# EAGLE board VCFA_v2_mix (EAGLE 9.4.2)
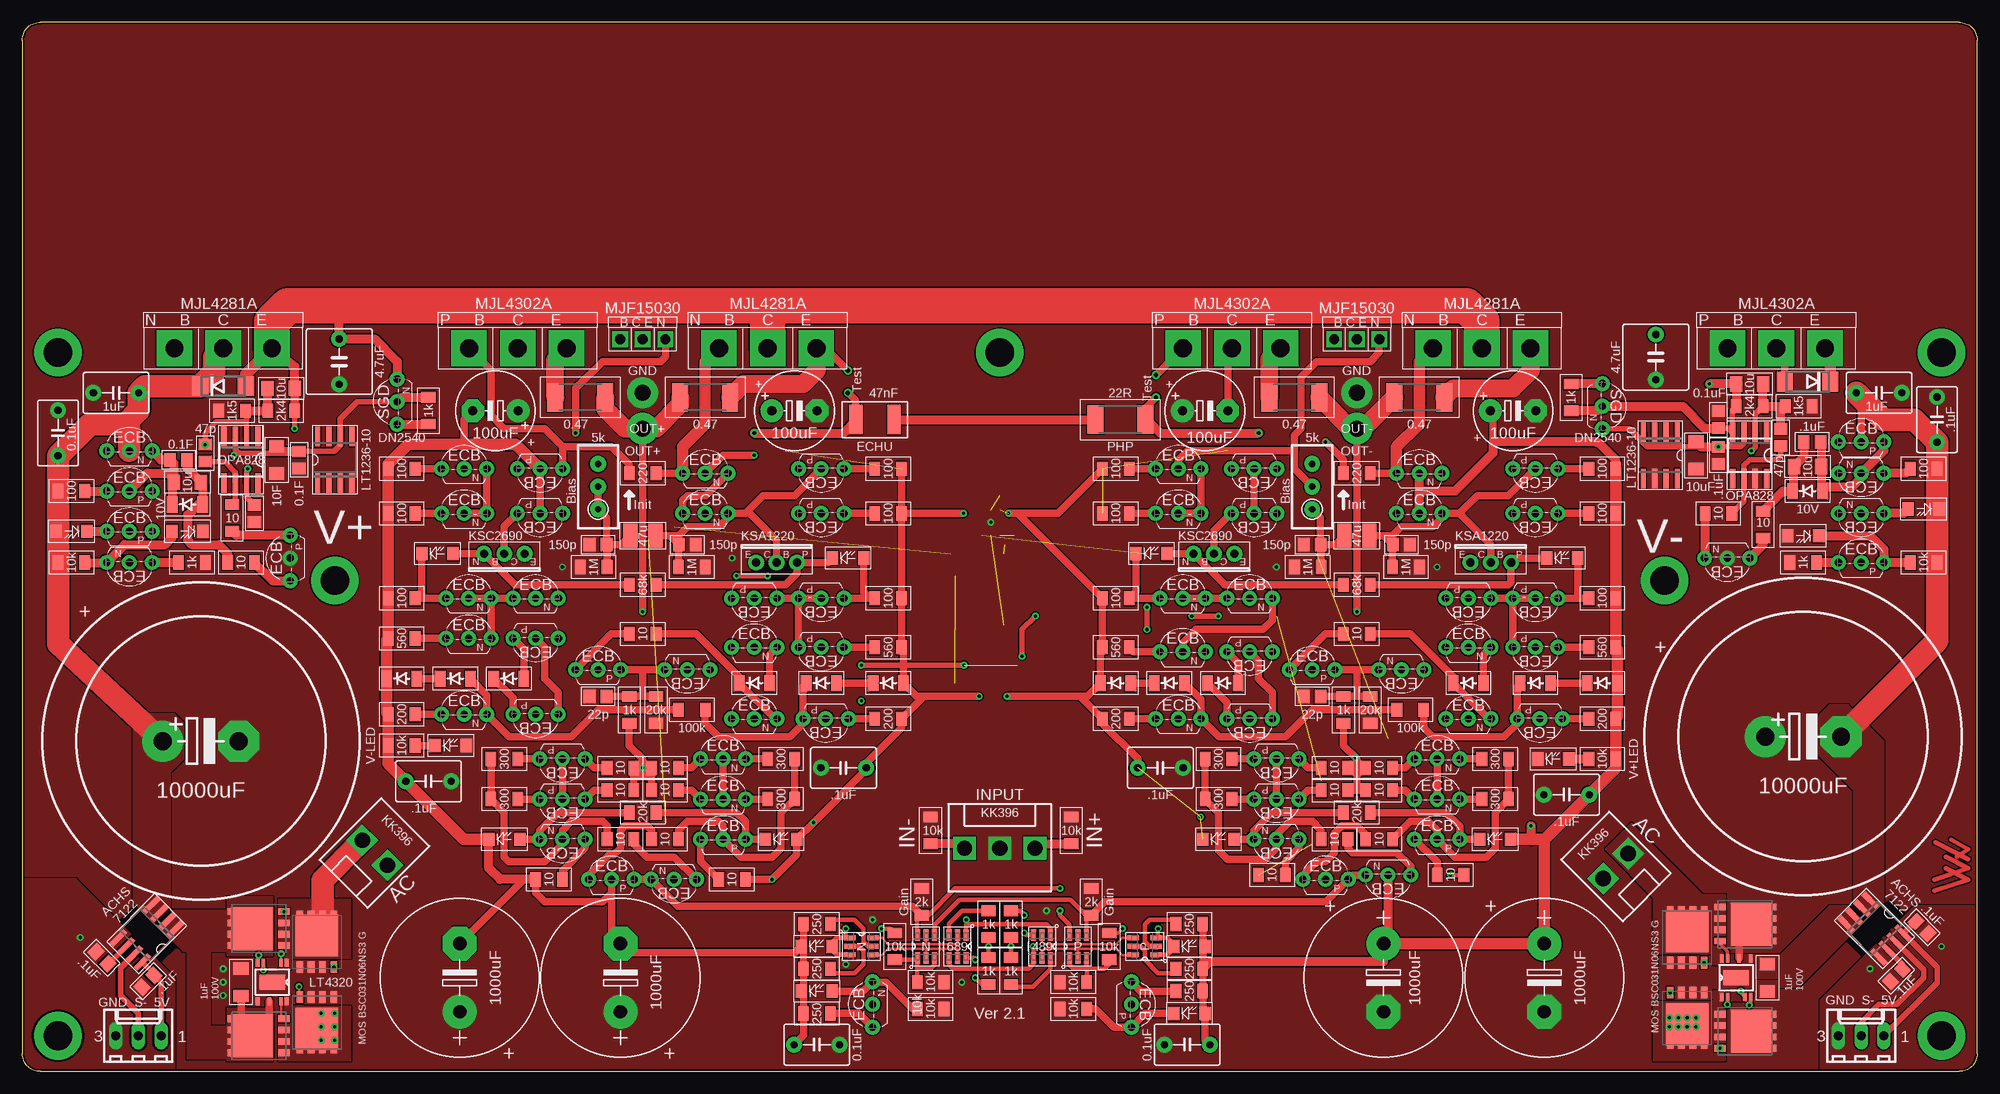
[diagram p4: board, top side]
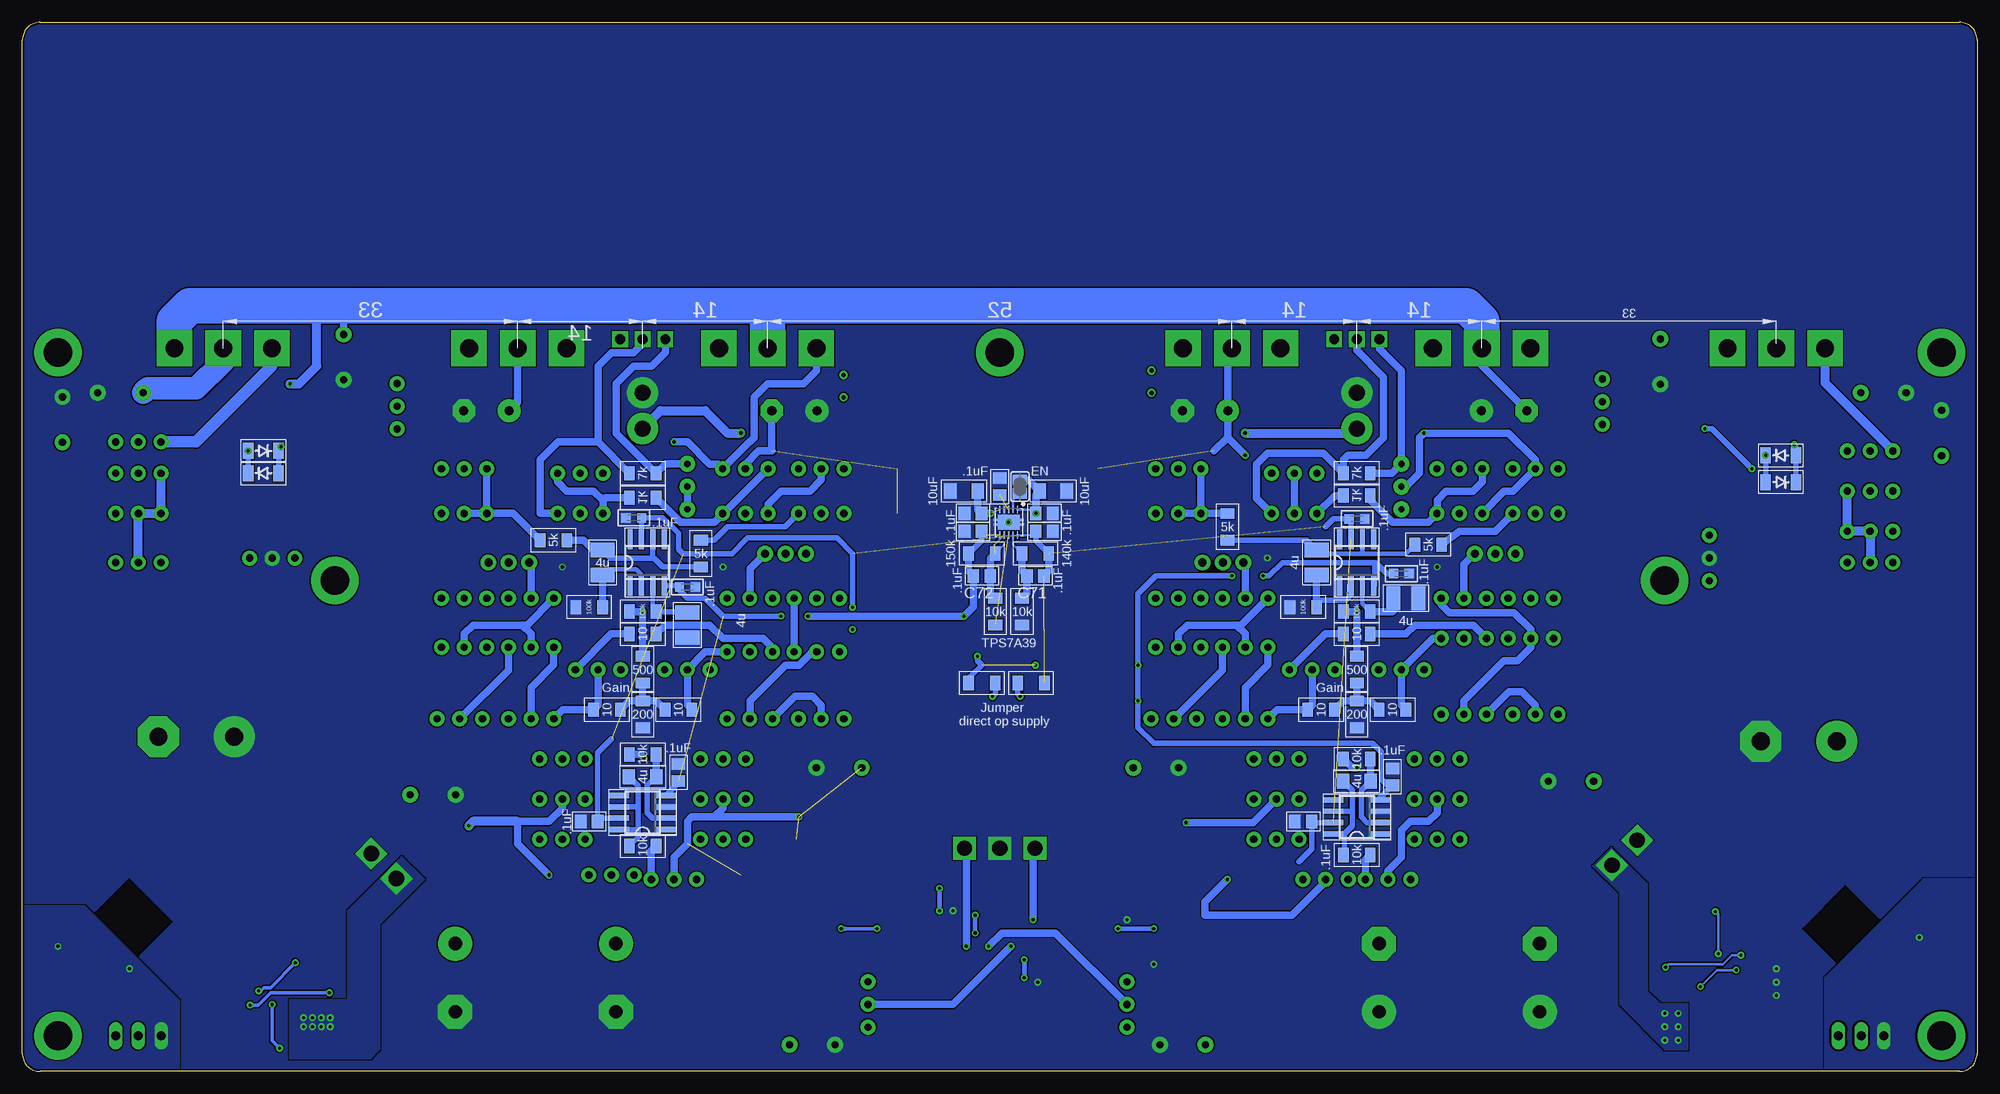
[diagram p5: board, bottom side, seen from below]

Size 219 x 117.5 mm. Coordinates in mm from the lower left corner, seen from the top.
Outline: 2,0 217,0 arc90 219,2 219,115.5 arc90 217,117.5 2,117.5 arc90 0,115.5 0,2 arc90 2,0
Copper layers (1*16): Top 0.035mm / dielectric 1.5mm / Bottom 0.035mm
Design rules "default *": minimum track width 6mil, minimum drill 0.35mm, track to track 6mil, track to pad 6mil, pad to pad 6mil, via to via 6mil, smd to smd 0mil, copper to edge 10mil, drill to drill 6mil, minimum pad ring 10mil, minimum via ring 8mil, stop-mask expansion 4mil, vias tented up to drill 0.35mm, thermal gap 3mil

## Footprints (pad centres in the part's own frame; a part is rotated, then mirrored left to right if it is on the bottom)
ECHU-Y = smd 1.5 x 3.3: 1 -2.15,0; 2 2.15,0
C0805 = smd 1.3 x 1.5: 1 -0.95,0; 2 0.95,0
E7,5-18 = drill 1.5 pad 3.81: + -3.81,0 | drill 1.5 pad 3.81 octagon: - 3.81,0
C050-045X075 = drill 0.813 pad 1.778: 1 -2.54,0; 2 2.54,0
C1206 = smd 1.4 x 1.7: 1 -1.527,0; 2 1.527,0
C1210 = smd 1.6 x 2.7: 1 -1.4,0; 2 1.4,0
C0603K = smd 1.05 x 1.08: 1 -0.875,0; 2 0.875,0
E5-8,5 = drill 1.016 pad 2.54: + -2.54,0 | drill 1.016 pad 2.54 octagon: - 2.54,0
EB35D-8.5 = drill 2.007 pad 4.597: + -4.25,0 | drill 2.007 pad 4.597 octagon: - 4.25,0
C050-075X075 = drill 0.813 pad 1.778: 1 -2.54,0; 2 2.54,0
SOD80C = smd 1.2 x 1.8: A 1.7,0; C -1.7,0
DO214AA = smd 1.8 x 2.2: A 2.55,0; C -2.55,0
SO8 = smd 0.6 x 2.2: 1 -1.905,-2.6; 2 -0.635,-2.6; 3 0.635,-2.6; 4 1.905,-2.6; 5 1.905,2.6; 6 0.635,2.6; 7 -0.635,2.6; 8 -1.905,2.6
M3_HOLE = drill 3.2 pad 5.334: P$1 0,0
SOIC8 = smd 0.6 x 2.2: 1 -1.905,-2.6; 2 -0.635,-2.6; 3 0.635,-2.6; 4 1.905,-2.6; 5 1.905,2.6; 6 0.635,2.6; 7 -0.635,2.6; 8 -1.905,2.6
6410-03 = drill 1.016 long: 1 2.54,0; 2 0,0; 3 -2.54,0
LED_SML1206 = smd 1.3 x 1.5: A 1.75,0; C -1.75,0
PAD-16 = drill 1.8 pad 3.5: P$1 0,0
SOT-23-6 = smd 1.27 x 0.559: 1 -1.295,0.95; 2 -1.295,0; 3 -1.295,-0.95; 4 1.295,-0.95; 5 1.295,0; 6 1.295,0.95
TRANSISTOR_TO92-ECB_P = drill 0.813 pad 1.676: B 2.54,0; C 0,0; E -2.54,0
TRANSISTOR_TO92-ECB_N = drill 0.813 pad 1.676: B 2.54,0; C 0,0; E -2.54,0
TRANSISTOR_TO126_P = drill 0.9 pad 1.778: B 2.286,0; C 0,0; E -2.286,0
TRANSISTOR_TO126_N = drill 0.9 pad 1.778: B 2.286,0; C 0,0; E -2.286,0
TRANSISTOR_TO220_BCE_N = drill 1.1 pad 1.778 square: B -2.54,0; C 0,0; E 2.54,0
TRANSISTOR_TO247_BCE_N = drill 2 pad 4 square: B -5.461,0; C 0,0; E 5.461,0
TRANSISTOR_TO247_BCE_P = drill 2 pad 4 square: B -5.461,0; C 0,0; E 5.461,0
TRANSISTOR_TO92-SGD_N = drill 0.813 pad 1.676: D 2.54,0; G 0,0; S -2.54,0
PG-TDSON-8 = smd 1.3 x 0.75: 1 -2.825,1.905; 2 -2.825,0.635; 3 -2.825,-0.635; 4 -2.825,-1.905; 5 2.825,-1.905; 6 2.825,-0.635; 7 2.825,0.635; 8 2.825,1.905 | smd 4.7 x 4.8: TH 0.725,0
MINI_MELF-0204W = smd 1.2 x 1.6: 1 -1.5,0; 2 1.5,0
RTRIM3296W = drill 0.7 pad 1.778: 1 0,-2.54; 2 0,0; 3 0,2.54
R2512 = smd 1.8 x 3.2: 1 -2.8,0; 2 2.8,0
SJ = smd 1.168 x 1.6: 1 -0.762,0; 2 0.762,0
LT4320_MSOP = smd 0.9 x 0.42: 1 -2.163,1.625; 2 -2.163,0.975; 5 -2.163,-0.975; 6 -2.163,-1.625; 7 2.15,-1.625; 9 2.15,-0.325; 11 2.15,0.975; 12 2.15,1.625 | smd 1.65 x 2.85: EXP 0,0
SON50P300X300X80-11T165X240N = smd 0.86 x 0.27: 1 -1.435,1; 2 -1.435,0.5; 3 -1.435,0; 4 -1.435,-0.5; 5 -1.435,-1; 6 1.435,-1; 7 1.435,-0.5; 8 1.435,0; 9 1.435,0.5; 10 1.435,1 | smd 1.65 x 2.4: 11 0,0 | smd 0.25 x 0.5: 12 0.25,1.45; 13 -0.25,1.435; 14 -0.25,-1.45; 15 0.25,-1.45
KK-156-3 = drill 1.7 pad 2.54 square: 1 -3.96,0; 2 0,0; 3 3.96,0
KK-156-2 = drill 1.7 pad 2.54 square: 1 -1.98,0; 2 1.98,0

## Placement (x,y rotation side)
C1  [ECHU-Y]  95.5,73 0 top
C2  0.1uF  [C0805]  109.5,65.5 90 bottom
C3  0.1uF  [C0805]  75.5,28 0 bottom
C4  0.1uF  [C0805]  65.5,33 90 bottom
C5  1000uF  [E7,5-18]  152.5,10.5 270 top
C6  1000uF  [E7,5-18]  49,10.5 90 top
C7  1000uF  [E7,5-18]  170.5,10.5 270 top
C8  1000uF  [E7,5-18]  67,10.5 90 top
C9  0.1uF  [C050-045X075]  92,34 180 top
C10  0.1uF  [C050-045X075]  127.5,34 180 top
C11  0.1uF  [C050-045X075]  173,31 180 top
C12  0.1uF  [C050-045X075]  45.5,32.5 180 top
C13  10uF  [C1206]  69.5,32.5 0 bottom
C14  0.1uF  [C0805]  155.5,28 0 bottom
C15  0.1uF  [C0805]  145.5,33.5 90 bottom
C16  10uF  [C1206]  149.5,33 0 bottom
C17  22p  [C0805]  64.5,42 180 top
C18  47u  [C1210]  69.5,60 180 top
C19  150p  [C0805]  74.5,59 180 top
C20  150p  [C0805]  64.5,59 180 top
C21  4.7uF  [C1210]  74,57 270 bottom
C22  4.7uF  [C1210]  64,53 180 bottom
C23  0.1uF  [C0603K]  69.46,61.89 0 bottom
C24  0.1uF  [C0603K]  64.5,55.75 180 bottom
C25  100uF  [E5-8,5]  86.5,74 0 top
C26  100uF  [E5-8,5]  53,74 180 top
C27  22p  [C0805]  144.5,42 180 top
C28  47u  [C1210]  149.5,60 180 top
C29  150p  [C0805]  154.5,59 180 top
C30  150p  [C0805]  144.5,59 180 top
C31  4.7uF  [C1210]  154,57 270 bottom
C32  4.7uF  [C1210]  144.5,50 90 bottom
C33  0.1uF  [C0603K]  150.5,62 180 bottom
C34  0.1uF  [C0603K]  144.5,54.25 180 bottom
C35  100uF  [E5-8,5]  167,74 0 top
C36  100uF  [E5-8,5]  132.5,74 0 top
C37  10000uF  [EB35D-8.5]  20,37 0 top
C38  10000uF  [EB35D-8.5]  199.5,37.5 0 top
C39  0.1uF  [C050-045X075]  208,76 0 top
C40  10uF  [C1206]  18.5,66 0 top
C41  10uF  [C1206]  200,67.75 0 top
C42  0.1uF  [C050-045X075]  10.5,76 0 top
C43  0.1uF  [C0805]  17.5,68.5 0 top
C44  0.1uF  [C0805]  200.5,70.5 0 top
C45  0.1uF  [C0805]  26,62.5 90 top
C46  0.1uF  [C0805]  190,73 90 top
C47  10uF  [C1206]  28.5,68.5 270 top
C48  10uF  [C1206]  187.5,69 90 top
C49  0.1uF  [C0805]  31,68.5 270 top
C50  0.1uF  [C0805]  190,69 90 top
C51  47p  [C0805]  20.5,69.25 90 top
C52  47p  [C0805]  197,71 90 top
C53  10uF  [C1206]  29,76.5 180 top
C54  10uF  [C1206]  193.5,77 180 top
C55  4.7uF  [C050-075X075]  35.5,79.5 90 top
C56  4.7uF  [C050-075X075]  183,80 270 top
C57  47uF  [C1206]  24.5,10 90 top
C58  0.1uF  [C050-045X075]  4,71.5 270 top
C59  47uF  [C1206]  195.5,10.5 90 top
C60  0.1uF  [C050-045X075]  214.5,73 90 top
C61  [C0805]  212.82,16.13 315 top
C62  [C0805]  209.95,10.73 225 top
C63  1n  [C0805]  8.91,12.73 135 top
C64  [C0805]  14.09,10.1 225 top
C65  10uF  [C1206]  113.5,65 180 bottom
C66  10uF  [C1206]  103.5,65 0 bottom
C67  0.1uF  [C0805]  112.5,62.5 180 bottom
C68  0.1uF  [C0805]  104.5,62.5 0 bottom
C69  0.1uF  [C0805]  104.5,60.5 0 bottom
C70  0.1uF  [C0805]  112.5,60.5 0 bottom
C71  0.1uF  [C0805]  105.5,55.5 180 bottom
C72  0.1uF  [C0805]  111.5,55.5 180 bottom
C74  0.1uF  [C050-045X075]  130.5,3 180 top
C75  0.1uF  [C050-045X075]  89,3 180 top
D1  LL4148  [SOD80C]  97,43.5 0 top
D2  LL4148  [SOD80C]  89.5,43.5 0 top
D3  LL4148  [SOD80C]  48.5,44 0 top
D4  LL4148  [SOD80C]  42.5,44 0 top
D5  LL4148  [SOD80C]  82,43.5 0 top
D6  LL4148  [SOD80C]  54.5,44 0 top
D7  LL4148  [SOD80C]  177,43.5 0 top
D8  LL4148  [SOD80C]  169.5,43.5 0 top
D9  LL4148  [SOD80C]  128.5,43.5 0 top
D10  LL4148  [SOD80C]  122.5,43.5 0 top
D11  LL4148  [SOD80C]  162,43.5 0 top
D12  LL4148  [SOD80C]  134.5,43.5 0 top
D13  BZT55B10  [SOD80C]  18.5,63.5 0 top
D14  BZT55B10  [SOD80C]  200,65 0 top
D15  S1G  [DO214AA]  22.5,76.75 0 top
D16  S1G  [DO214AA]  200,77.25 180 top
D17  LT1236-10  [SO8]  35,68.5 0 top
D18  LT1236-10  [SO8]  183.5,69 180 top
D19  LL4148  [SOD80C]  22,69 0 bottom
D20  LL4148  [SOD80C]  22,66 180 bottom
D21  LL4148  [SOD80C]  192,67 0 bottom
D22  LL4148  [SOD80C]  192,69.5 180 bottom
H1  HOLE  [M3_HOLE]  4,4 0 top
H2  HOLE  [M3_HOLE]  215,4 0 top
H3  HOLE  [M3_HOLE]  4,80.5 0 top
H4  HOLE  [M3_HOLE]  215,80.5 0 top
H5  HOLE  [M3_HOLE]  35,55 0 top
H6  HOLE  [M3_HOLE]  129,-13 0 top  (outside the outline)
H7  HOLE  [M3_HOLE]  184,55 0 top
H8  HOLE  [M3_HOLE]  109.5,80.5 0 top
IC1  LTC2057HV  [SOIC8]  69.5,28.5 90 bottom
IC2  LTC2057HV  [SOIC8]  149.5,29 90 bottom
IC3  LTC2057HV  [SOIC8]  69.5,57 0 bottom
IC4  LTC2057HV  [SOIC8]  149,57 0 bottom
IC5  OPA827  [SOIC8]  193.5,69 180 top
IC6  OPA827  [SOIC8]  24.5,68.5 180 top
J1  22-27-2031-03  [6410-03]  13,4 0 top
J2  22-27-2031-03  [6410-03]  206,4 0 top
LED1  RED  [LED_SML1206]  130.75,6.5 0 top
LED2  RED  [LED_SML1206]  89,9 0 top
LED3  RED  [LED_SML1206]  130.75,14 0 top
LED4  RED  [LED_SML1206]  89,14 0 top
LED5  RED  [LED_SML1206]  85,26 0 top
LED6  RED  [LED_SML1206]  54,26 0 top
LED7  RED  [LED_SML1206]  165,26 0 top
LED8  RED  [LED_SML1206]  134,26 0 top
LED9  RED  [LED_SML1206]  92.5,57.5 0 top
LED10  RED  [LED_SML1206]  46.5,58 0 top
LED11  RED  [LED_SML1206]  172.5,57.5 0 top
LED12  RED  [LED_SML1206]  126.5,58 0 top
LED13  RED  [LED_SML1206]  18.5,60.5 180 top
LED14  RED  [LED_SML1206]  199.5,60 180 top
LED15  RED  [LED_SML1206]  5.5,60.5 180 top
LED16  RED  [LED_SML1206]  213,63 180 top
LED17  RED  [LED_SML1206]  171.5,35 0 top
LED18  RED  [LED_SML1206]  48,36.5 0 top
PAD1  PAD  [PAD-16]  69.5,72 0 top
PAD2  PAD  [PAD-16]  149.5,72 0 top
PAD3  PAD  [PAD-16]  149.5,76 0 top
PAD4  PAD  [PAD-16]  69.5,76 0 top
Q1  LSK689  [SOT-23-6]  104.75,14 270 top
Q2  KSA992  [TRANSISTOR_TO92-ECB_P]  124.25,7.5 270 top
Q3  KSC1845  [TRANSISTOR_TO92-ECB_N]  95.25,7.5 90 top
Q4  LSK489  [SOT-23-6]  114.25,14 270 top
Q5  LS3550  [SOT-23-6]  118.25,14 90 top
Q6  LS3250  [SOT-23-6]  101.25,14 90 top
Q7  LS3250  [SOT-23-6]  94,14 0 top
Q8  LS3550  [SOT-23-6]  125.75,14 180 top
Q9  KSC1845  [TRANSISTOR_TO92-ECB_N]  73,21.5 180 top
Q10  KSA992  [TRANSISTOR_TO92-ECB_P]  66,21.5 0 top
Q11  KSA992  [TRANSISTOR_TO92-ECB_P]  78.5,26 0 top
Q12  KSC1845  [TRANSISTOR_TO92-ECB_N]  60.5,26 180 top
Q13  KSC1845  [TRANSISTOR_TO92-ECB_N]  78.5,35 0 top
Q14  KSA992  [TRANSISTOR_TO92-ECB_P]  60.5,35 180 top
Q15  KSC1845  [TRANSISTOR_TO92-ECB_N]  78.5,30.5 0 top
Q16  KSA992  [TRANSISTOR_TO92-ECB_P]  60.5,30.5 180 top
Q17  KSC1845  [TRANSISTOR_TO92-ECB_N]  153,22 180 top
Q18  KSA992  [TRANSISTOR_TO92-ECB_P]  146,21.5 0 top
Q19  KSA992  [TRANSISTOR_TO92-ECB_P]  158.5,26 0 top
Q20  KSC1845  [TRANSISTOR_TO92-ECB_N]  140.5,26 180 top
Q21  KSC1845  [TRANSISTOR_TO92-ECB_N]  158.5,35 0 top
Q22  KSA992  [TRANSISTOR_TO92-ECB_P]  140.5,35 180 top
Q23  KSC1845  [TRANSISTOR_TO92-ECB_N]  158.5,30.5 0 top
Q24  KSA992  [TRANSISTOR_TO92-ECB_P]  140.5,30.5 180 top
Q25  KSA992  [TRANSISTOR_TO92-ECB_P]  90,39.5 180 top
Q26  KSA992  [TRANSISTOR_TO92-ECB_P]  64.5,45 0 top
Q27  KSC1845  [TRANSISTOR_TO92-ECB_N]  74.5,45 180 top
Q28  KSC1845  [TRANSISTOR_TO92-ECB_N]  49.5,40 0 top
Q29  KSC1845  [TRANSISTOR_TO92-ECB_N]  82,47.5 0 top
Q30  KSC1845  [TRANSISTOR_TO92-ECB_N]  82,39.5 0 top
Q31  KSA992  [TRANSISTOR_TO92-ECB_P]  57.5,48.5 180 top
Q32  KSA992  [TRANSISTOR_TO92-ECB_P]  57.5,40 180 top
Q33  KSA992  [TRANSISTOR_TO92-ECB_P]  89.5,47.5 180 top
Q34  KSC1845  [TRANSISTOR_TO92-ECB_N]  50,48.5 0 top
Q35  KSA992  [TRANSISTOR_TO92-ECB_P]  89.5,53 180 top
Q36  KSA992  [TRANSISTOR_TO92-ECB_P]  82,53 180 top
Q37  KSC1845  [TRANSISTOR_TO92-ECB_N]  57.5,53 0 top
Q38  KSC1845  [TRANSISTOR_TO92-ECB_N]  50,53 0 top
Q39  KSA1220  [TRANSISTOR_TO126_P]  84.5,57 0 top
Q40  KSC2690  [TRANSISTOR_TO126_N]  54,58 180 top
Q41  KSA992  [TRANSISTOR_TO92-ECB_P]  89.5,62.5 180 top
Q42  KSC1845  [TRANSISTOR_TO92-ECB_N]  49.5,62.5 0 top
Q43  KSA992  [TRANSISTOR_TO92-ECB_P]  89.5,67.5 180 top
Q44  KSC1845  [TRANSISTOR_TO92-ECB_N]  49.5,67.5 0 top
Q45  MJE15030  [TRANSISTOR_TO220_BCE_N]  69.5,82 0 top
Q46  KSC1845  [TRANSISTOR_TO92-ECB_N]  76.5,62.5 0 top
Q47  KSA992  [TRANSISTOR_TO92-ECB_P]  58,62.5 180 top
Q48  KSC1845  [TRANSISTOR_TO92-ECB_N]  76.5,67 0 top
Q49  KSA992  [TRANSISTOR_TO92-ECB_P]  58,67.5 180 top
Q50  MJL4281A  [TRANSISTOR_TO247_BCE_N]  83.5,81 0 top
Q51  MJL4302A  [TRANSISTOR_TO247_BCE_P]  55.5,81 0 top
Q52  KSA992  [TRANSISTOR_TO92-ECB_P]  170,39.5 180 top
Q53  KSA992  [TRANSISTOR_TO92-ECB_P]  144.5,45 0 top
Q54  KSC1845  [TRANSISTOR_TO92-ECB_N]  154.5,45 180 top
Q55  KSC1845  [TRANSISTOR_TO92-ECB_N]  129.5,39.5 0 top
Q56  KSC1845  [TRANSISTOR_TO92-ECB_N]  162,47.5 0 top
Q57  KSC1845  [TRANSISTOR_TO92-ECB_N]  162,39.5 0 top
Q58  KSA992  [TRANSISTOR_TO92-ECB_P]  137.5,47 180 top
Q59  KSA992  [TRANSISTOR_TO92-ECB_P]  137.5,39.5 180 top
Q60  KSA992  [TRANSISTOR_TO92-ECB_P]  169.5,47.5 180 top
Q61  KSC1845  [TRANSISTOR_TO92-ECB_N]  130,47 0 top
Q62  KSA992  [TRANSISTOR_TO92-ECB_P]  169.5,53 180 top
Q63  KSA992  [TRANSISTOR_TO92-ECB_P]  162,53 180 top
Q64  KSC1845  [TRANSISTOR_TO92-ECB_N]  137.5,53 0 top
Q65  KSC1845  [TRANSISTOR_TO92-ECB_N]  130,53 0 top
Q66  KSA1220  [TRANSISTOR_TO126_P]  164.5,57 0 top
Q67  KSC2690  [TRANSISTOR_TO126_N]  133.5,58 180 top
Q68  KSA992  [TRANSISTOR_TO92-ECB_P]  169.5,62.5 180 top
Q69  KSC1845  [TRANSISTOR_TO92-ECB_N]  129.5,62.5 0 top
Q70  KSA992  [TRANSISTOR_TO92-ECB_P]  169.5,67.5 180 top
Q71  KSC1845  [TRANSISTOR_TO92-ECB_N]  129.5,67.5 0 top
Q72  MJE15030  [TRANSISTOR_TO220_BCE_N]  149.5,82 0 top
Q73  KSC1845  [TRANSISTOR_TO92-ECB_N]  156.5,62.5 0 top
Q74  KSA992  [TRANSISTOR_TO92-ECB_P]  138,62.5 180 top
Q75  KSC1845  [TRANSISTOR_TO92-ECB_N]  156.5,67 0 top
Q76  KSA992  [TRANSISTOR_TO92-ECB_P]  138,67.5 180 top
Q77  MJL4281A  [TRANSISTOR_TO247_BCE_N]  163.5,81 0 top
Q78  MJL4302A  [TRANSISTOR_TO247_BCE_P]  135.5,81 0 top
Q79  KSC1845  [TRANSISTOR_TO92-ECB_N]  12,57 180 top
Q80  KSA992  [TRANSISTOR_TO92-ECB_P]  206,57 0 top
Q81  KSA992  [TRANSISTOR_TO92-ECB_P]  12,60.5 0 top
Q82  KSC1845  [TRANSISTOR_TO92-ECB_N]  206,62.5 180 top
Q83  KSA992  [TRANSISTOR_TO92-ECB_P]  12,65 0 top
Q84  KSC1845  [TRANSISTOR_TO92-ECB_N]  206,67 180 top
Q85  KSA992  [TRANSISTOR_TO92-ECB_P]  30,57.5 90 top
Q86  KSC1845  [TRANSISTOR_TO92-ECB_N]  191,57.5 180 top
Q87  KSC1845  [TRANSISTOR_TO92-ECB_N]  12,69.5 0 top
Q88  KSA992  [TRANSISTOR_TO92-ECB_P]  206,70.5 0 top
Q89  MJL4281A  [TRANSISTOR_TO247_BCE_N]  22.5,81 0 top
Q90  MJL4302A  [TRANSISTOR_TO247_BCE_P]  196.5,81 0 top
Q91  DN2540  [TRANSISTOR_TO92-SGD_N]  42,75 90 top
Q92  DN2540  [TRANSISTOR_TO92-SGD_N]  177,74.5 270 top
Q97  MOS_SMDTDSON-8  [PG-TDSON-8]  26.5,16 180 top
Q98  MOS_SMDTDSON-8  [PG-TDSON-8]  26.5,4 180 top
Q99  MOS_SMDTDSON-8  [PG-TDSON-8]  33,5.5 270 top
Q100  MOS_SMDTDSON-8  [PG-TDSON-8]  33,14.5 90 top
Q105  MOS_SMDTDSON-8  [PG-TDSON-8]  193,4.5 0 top
Q106  MOS_SMDTDSON-8  [PG-TDSON-8]  193,16.5 0 top
Q107  MOS_SMDTDSON-8  [PG-TDSON-8]  186.5,15 90 top
Q108  MOS_SMDTDSON-8  [PG-TDSON-8]  186.5,6 270 top
R3  10K  [MINI_MELF-0204W]  117.75,7 0 top
R4  10K  [MINI_MELF-0204W]  101.75,7 0 top
R5  250  [MINI_MELF-0204W]  130.75,9 0 top
R6  1K  [MINI_MELF-0204W]  108.25,16.5 270 top
R7  250  [MINI_MELF-0204W]  89,6.5 0 top
R8  1K  [MINI_MELF-0204W]  108.25,11.25 90 top
R9  1K  [MINI_MELF-0204W]  110.75,16.5 90 top
R10  1K  [MINI_MELF-0204W]  110.75,11.25 270 top
R11  2k  [MINI_MELF-0204W]  100.75,19 270 top
R12  250  [MINI_MELF-0204W]  130.75,16.5 0 top
R13  250  [MINI_MELF-0204W]  89,16.5 0 top
R14  10K  [MINI_MELF-0204W]  121.75,14 90 top
R15  10K  [MINI_MELF-0204W]  117.75,10 0 top
R16  10K  [MINI_MELF-0204W]  101.75,10 0 top
R17  10K  [MINI_MELF-0204W]  97.75,14 270 top
R18  250  [MINI_MELF-0204W]  130.75,11.5 0 top
R19  250  [MINI_MELF-0204W]  89,11.5 0 top
R20  2k  [MINI_MELF-0204W]  119.75,19 270 top
R21  10K  [MINI_MELF-0204W]  69.5,24.25 0 bottom
R22  20K  [MINI_MELF-0204W]  69.5,29 0 top
R23  250  [MINI_MELF-0204W]  79.5,21.5 0 top
R24  10  [MINI_MELF-0204W]  72,26 180 top
R25  10  [MINI_MELF-0204W]  67,26 180 top
R26  250  [MINI_MELF-0204W]  59,21.5 0 top
R27  300  [MINI_MELF-0204W]  85,35 0 top
R28  300  [MINI_MELF-0204W]  54,35 0 top
R29  10K  [MINI_MELF-0204W]  69.5,35 0 bottom
R30  10  [MINI_MELF-0204W]  72,34 0 top
R31  10  [MINI_MELF-0204W]  67,34 0 top
R32  300  [MINI_MELF-0204W]  85,30.5 0 top
R33  300  [MINI_MELF-0204W]  54,30.5 0 top
R34  10  [MINI_MELF-0204W]  72,31.5 0 top
R35  10  [MINI_MELF-0204W]  67,31.5 0 top
R36  10K  [MINI_MELF-0204W]  149.5,25.25 0 bottom
R37  20K  [MINI_MELF-0204W]  149.5,29 0 top
R38  250  [MINI_MELF-0204W]  160,22 0 top
R39  10  [MINI_MELF-0204W]  152,26 180 top
R40  10  [MINI_MELF-0204W]  147,26 180 top
R41  250  [MINI_MELF-0204W]  140,22 0 top
R42  300  [MINI_MELF-0204W]  165,35 0 top
R43  300  [MINI_MELF-0204W]  134,35 0 top
R44  10K  [MINI_MELF-0204W]  149.5,35.5 0 bottom
R45  10  [MINI_MELF-0204W]  152,34 0 top
R46  10  [MINI_MELF-0204W]  147,34 0 top
R47  300  [MINI_MELF-0204W]  165,30.5 0 top
R48  300  [MINI_MELF-0204W]  134,30.5 0 top
R49  10  [MINI_MELF-0204W]  152,31.5 0 top
R50  10  [MINI_MELF-0204W]  147,31.5 0 top
R51  1k  [MINI_MELF-0204W]  68,40.5 270 top
R52  20k  [MINI_MELF-0204W]  71,40.5 90 top
R53  100k  [MINI_MELF-0204W]  75,40.5 0 top
R54  200  [MINI_MELF-0204W]  97,39.5 0 top
R55  10  [MINI_MELF-0204W]  69.5,49 0 top
R56  10  [MINI_MELF-0204W]  69.5,49 180 bottom
R57  200  [MINI_MELF-0204W]  42.5,40 0 top
R58  560  [MINI_MELF-0204W]  97,47.5 0 top
R59  10  [MINI_MELF-0204W]  73.5,40.5 180 bottom
R60  10  [MINI_MELF-0204W]  65.5,40.5 180 bottom
R61  560  [MINI_MELF-0204W]  42.5,48.5 0 top
R62  100  [MINI_MELF-0204W]  97,53 0 top
R63  200  [MINI_MELF-0204W]  69.5,40 90 bottom
R64  100  [MINI_MELF-0204W]  42.5,53 0 top
R65  68k  [MINI_MELF-0204W]  69.5,54.5 0 top
R66  500  [MINI_MELF-0204W]  69.5,45 90 bottom
R67  100  [MINI_MELF-0204W]  97,62.5 0 top
R68  5k  [MINI_MELF-0204W]  84,61 90 bottom
R69  5k  [MINI_MELF-0204W]  61.5,59 180 bottom
R70  100  [MINI_MELF-0204W]  42.5,62.5 0 top
R71  100  [MINI_MELF-0204W]  97,67.5 0 top
R72  100  [MINI_MELF-0204W]  42.5,67.5 0 top
R73  7k  [MINI_MELF-0204W]  69.5,67 180 bottom
R74  5k  [RTRIM3296W]  64.5,65.5 0 top
R75  1M  [MINI_MELF-0204W]  75,56.5 0 top
R76  1M  [MINI_MELF-0204W]  64,56.5 0 top
R77  1k  [MINI_MELF-0204W]  69.5,64.5 180 bottom
R78  220  [MINI_MELF-0204W]  69.5,67 0 top
R79  100k  [MINI_MELF-0204W]  75.5,52 0 bottom
R80  0.5  [R2512]  76.5,75.5 0 top
R81  0.5  [R2512]  62.5,75.5 0 top
R82  100k  [MINI_MELF-0204W]  69.5,51.5 0 bottom
R83  1k  [MINI_MELF-0204W]  148,40.5 270 top
R84  20k  [MINI_MELF-0204W]  151,40.5 90 top
R85  100k  [MINI_MELF-0204W]  155.5,40.5 0 top
R86  200  [MINI_MELF-0204W]  177,39.5 0 top
R87  10  [MINI_MELF-0204W]  149.5,49 0 top
R88  10  [MINI_MELF-0204W]  149.5,49 180 bottom
R89  200  [MINI_MELF-0204W]  122.5,39.5 0 top
R90  560  [MINI_MELF-0204W]  177,47.5 0 top
R91  10  [MINI_MELF-0204W]  153.5,40.5 180 bottom
R92  10  [MINI_MELF-0204W]  145.5,40.5 180 bottom
R93  560  [MINI_MELF-0204W]  122.5,47.5 0 top
R94  100  [MINI_MELF-0204W]  177,53 0 top
R95  200  [MINI_MELF-0204W]  149.5,40 90 bottom
R96  100  [MINI_MELF-0204W]  122.5,53 0 top
R97  68k  [MINI_MELF-0204W]  149.5,54.5 0 top
R98  500  [MINI_MELF-0204W]  149.5,45 90 bottom
R99  100  [MINI_MELF-0204W]  177,62.5 0 top
R100  5k  [MINI_MELF-0204W]  159.5,59.5 180 bottom
R101  5k  [MINI_MELF-0204W]  143,58 270 bottom
R102  100  [MINI_MELF-0204W]  122.5,62.5 0 top
R103  100  [MINI_MELF-0204W]  177,67.5 0 top
R104  100  [MINI_MELF-0204W]  122.5,67.5 0 top
R105  7k  [MINI_MELF-0204W]  149.5,67 180 bottom
R106  5k  [RTRIM3296W]  144.5,65.5 0 top
R107  1M  [MINI_MELF-0204W]  155,56.5 0 top
R108  1M  [MINI_MELF-0204W]  144,56.5 0 top
R109  1k  [MINI_MELF-0204W]  149.5,64.25 180 bottom
R110  220  [MINI_MELF-0204W]  149.5,67 0 top
R111  100k  [MINI_MELF-0204W]  155.5,52 0 bottom
R112  0.5  [R2512]  156.5,75.5 0 top
R113  0.5  [R2512]  142.5,75.5 0 top
R114  100k  [MINI_MELF-0204W]  149.5,51.5 0 bottom
R115  10k  [MINI_MELF-0204W]  5.5,57 0 top
R116  10k  [MINI_MELF-0204W]  213,57 0 top
R117  1k  [MINI_MELF-0204W]  19,57 0 top
R118  1k  [MINI_MELF-0204W]  199.5,57 0 top
R119  100  [MINI_MELF-0204W]  5.5,65 0 top
R120  10  [MINI_MELF-0204W]  24.5,57 0 top
R121  10  [MINI_MELF-0204W]  195,61.25 90 top
R122  100  [MINI_MELF-0204W]  213,67.5 0 top
R123  10  [MINI_MELF-0204W]  23.5,62 270 top
R124  10  [MINI_MELF-0204W]  190,62.5 180 top
R125  1k  [MINI_MELF-0204W]  45.5,74 270 top
R126  1k  [MINI_MELF-0204W]  173.5,75.5 90 top
R127  1.5k  [MINI_MELF-0204W]  29,74 0 top
R128  1.5k  [MINI_MELF-0204W]  23.5,74 0 top
R129  1.5k  [MINI_MELF-0204W]  199,74.5 0 top
R130  1.5k  [MINI_MELF-0204W]  193.5,74.5 0 top
R131  10k  [MINI_MELF-0204W]  177,35 0 top
R132  10k  [MINI_MELF-0204W]  42.5,36.5 0 top
R133  [R2512]  123,73 0 top
R134  10K  [MINI_MELF-0204W]  117.5,27 270 top
R135  10K  [MINI_MELF-0204W]  101.75,27 270 top
R136  10k  [MINI_MELF-0204W]  105.5,58 0 bottom
R137  10k  [MINI_MELF-0204W]  107,51.5 90 bottom
R138  10k  [MINI_MELF-0204W]  110,51.5 270 bottom
R139  10k  [MINI_MELF-0204W]  111.5,58 0 bottom
R140  10k  [MINI_MELF-0204W]  111.5,43.5 0 bottom
R141  10k  [MINI_MELF-0204W]  106,43.5 180 bottom
S1  VWV  [VWV]  218,22.75 90 top
SJ1  [SJ]  107.25,65.5 90 bottom
U$1  ACHS-712X  [SO8]  13.94,15.44 135 top
U$2  LT4320MSOP  [LT4320_MSOP]  28,10 270 top
U$3  ACHS-712X  [SO8]  207.5,16 225 top
U$4  LT4320MSOP  [LT4320_MSOP]  192,10.5 90 top
U$5  TPS7A39WSON10-7A39  [SON50P300X300X80-11T165X240N]  108.5,61.5 270 bottom
X1  KK-156-3  [KK-156-3]  109.5,25 0 top
X2  [KK-156-2]  178.5,23 225 top
X3  [KK-156-2]  39.5,24.5 135 top

## Tracks (layer width: path | path; a pad name or v marks a point on that pad's centre or on a via)
+18V  (via drill 0.35)  (5 unrouted)
  Top 0.61: v126,52 v126,49.5
  Bottom 0.254: U$5.10 105.89,60.06 C69.1
  Bottom 0.61: IC4.7 C33.1 147.25,62 145.5,60.25 145.5,58.5 145,58 139.5,58 137.75,59.75 127.75,59.75 126,58 v126,52 | 73,61 72.11,61.89 C23.1 70.14,61.69 IC3.7 | IC1.7 74.42,27.86 C3.2 74.55,24.95 76,23.5 | C69.1 105.45,59.45 R136.2 | IC2.7 154.19,28.36 C14.2 154.55,35.7 153,37.25
  Bottom 0.813: C71.1 104,56.05 R136.2
-18V  (via drill 0.35)  (3 unrouted)
  Top 0.61: v134,51 v131,51 | v112,46.5 112,49.5 v113.5,51 | v105.5,45.5 v94,45.5 | v83.5,55.5 v80,55.5
  Bottom 0.254: 111.11,60.06 C70.2
  Bottom 0.61: IC4.4 145.53,54.4 C34.2 145.38,53.88 144.5,53 142.5,53 140.5,51 v134,51 | C24.2 66.12,55.75 67.38,57 67.5,57 | 67.5,57 77.82,57 79.32,55.5 v80,55.5 | IC1.4 66.9,30.65 C4.1 66.05,32.05 66.75,32.75 66.75,35.8 67.21,36.26 67.26,36.26 67.75,36.75 92.25,36.75 94,38.5 v94,41.5 v94,45.5 94,53.5 92,55.5 v83.5,55.5 | C70.2 111.55,59.45 R139.1 | IC3.4 67.5,54.49 67.5,57 | IC2.4 145.5,32.3 C15.1 145.45,32.5 | R140.1 112.75,43.25 112.75,44.25 111.5,45.5 112,46 v112,46.5
  Bottom 0.813: R139.1 113,56.05 C72.2 112.45,52.05 v113.5,51 v131,51
AC1
  Top 2.54: X3.2 33.63,21.43 Q100.6
  pour Top (no thermals): 28.75,19.25 28.75,11.5 30,11.5 30,12.5 30.25,12.75 36.75,12.75 36.75,19.25
AC2  (via drill 0.35)
  other vias: 33.5,6.5 33.5,5 33.5,3.5 35,3.5 35,5 35,6.5
  pour Top (no thermals): 28.75,1.25 28.75,8.5 30,8.5 30,7.5 30.25,7.25 36.75,7.25 36.75,1.25
  pour Bottom (no thermals): 41,25 37,21 37,9 35.5,7.5 32.5,7.5 32.5,2.5 35,2.5 40,7.5 40,20 43,23
AC3  (via drill 0.35)
  other vias: 184.5,6 185.5,6 186.5,6 187.5,6 187.5,5 186.5,5 185.5,5 184.5,5
  pour Top (no thermals): 190.75,1.25 190.75,9 189.5,9 189.5,8 189.25,7.75 182.75,7.75 182.75,1.25
  pour Bottom (no thermals): 176.5,24 182.5,18 182.5,8 189,8 189,1.5 180,1.5 179,2.5 179,16.5 174,21.5
AC4
  pour Top (no thermals): 190.75,19.75 190.75,12 189.5,12 189.5,13 189.25,13.25 182.75,13.25 182.75,19.75
  pour Top (no thermals): 177.38,24.88 183,19.25 183,19 189,19 180.25,27.75
BOUT+  (via drill 0.35)
  Top 0.813: R31.2 68.5,33 | 68.5,33 R35.2 | R30.1 70.5,33 | 70.5,33 R34.1 | 68.5,33 69.5,33 | 69.5,33 70.5,33 | R51.2 68,36.5 69.5,35 v69.5,34 69.5,33
  Bottom 0.813: R29.1 70,34 v69.5,34
BOUT-  (via drill 0.35)
  Top 0.813: R46.2 149.5,34 | 149.5,34 R45.1 | R50.2 149.5,31.5 | 149.5,31.5 R49.1 | 149.5,34 149.5,31.5 | R83.2 148,36.5 v149.38,35.12 149.5,35 149.5,34
  Bottom 0.813: R44.1 149.75,35.5 v149.38,35.12
D5V1
  Top 0.61: U$1.8 14.76,10.94 C64.1 15.54,9.99 J1.1
D5V2
  Top 0.61: J2.1 214.5,9.96 214.5,11.69 U$3.8 210.85,15.51 C61.1
DGND1  (via drill 0.35)
  other vias: 6.5,15
  pour Top (isolate 0.254, no thermals): 0,21.5 6,21.5 17,10.5 17,0 0,0
  pour Bottom (isolate 0.254, no thermals): 0,21.5 6,21.5 17,10.5 17,0 0,0
DGND2  (via drill 0.35)
  other vias: 207,11.5 215,14
  pour Top (no thermals): 201.5,8 212,18.5 219,18.5 219,0 201.5,0
  pour Bottom (no thermals): 201.5,8 212,18.5 219,18.5 219,0 201.5,0
GND  (via drill 0.35)
  Top 0.813: U$4.9 192.32,13.82
  other vias: 158.5,56.5 140.5,56.5 60.5,56.5 105.25,10 22.5,11.5 22.5,10 22.5,8.5 108.5,61.5 79.5,57.5 114.75,18 95.25,17 92.25,12
  pour Bottom (isolate 0.125, rank 5, no thermals): -0.5,123.49 218.94,123.49 218.94,-0.04 -0.5,-0.04
  pour Top (isolate 0.125, rank 5, no thermals): -0.5,117.99 218.94,117.99 218.94,-0.04 -0.5,-0.04
IN+  (via drill 0.35)
  Top 0.508: Q1.4 103.8,11.95 104.25,11.5 112.75,11.5 113.3,12.05 Q4.4 113.3,13.95 v113.25,14
  Top 1.016: X1.3 113.96,25.5 R134.2
  Bottom 0.813: X1.3 113.46,24.67 113.25,24.46 v113.25,14
IN-  (via drill 0.35)
  Top 0.508: Q4.1 115.2,16.05 114.75,16.5 105.75,16.5 | Q1.1 105.7,16.45 105.75,16.5 | 105.75,16.5 v105.75,17
  Top 1.016: X1.1 105.04,25.5 R135.2
  Bottom 0.813: X1.1 105.54,24.25 105.75,24.04 v105.75,17
N$1
  Bottom 1.016: Q79.C Q81.C Q81.B Q83.B
N$2
  Top 0.508: Q8.2 126.25,14 125.75,14.5 125.75,16.5 126.25,17 128.75,17 R12.1
N$3
  Top 0.813: R54.1 Q25.E
N$4
  Top 0.813: Q10.E 63.46,21.96 65.75,24.25 66.25,24.25 67,25 67,27 67.5,27.5 70,27.5 70.5,27 R24.2
N$5
  Top 0.813: R26.2 60.5,22.5 63.04,25.04 Q12.E
N$6
  Top 0.813: R23.1 75.96,23.54 Q11.E
N$7
  Top 0.813: LED5.C Q11.B 81,26.04 81,28 80,29 R22.2
N$8
  Top 0.813: R22.1 60,29 57.96,26.96 Q12.B LED6.A
N$9
  Top 0.813: R24.1 73.5,27 74.5,28 78,28 78.5,27.5 Q11.C 80.5,24 84,24 85,25 85,29 R32.2 R27.2
N$10
  Top 0.813: R25.2 65.5,27.5 65,28 61.5,28 60.5,27 Q12.C 60.5,25.5 58.5,23.5 54.5,23.5 54,24 54,29 R33.1 R28.1
N$11
  Top 0.813: Q9.E 73.04,24 70,24 68.5,25.5 R25.1
N$12
  Top 0.813: D5.A 83.7,46.66 Q29.B
  Bottom 0.813: Q25.C 84.54,44.96 Q29.B
N$13
  Top 0.813: R27.1 Q13.B
N$14
  Top 0.813: Q13.E 74.96,34 R30.2
N$15
  Top 0.813: R33.2 Q16.B
N$16
  Top 0.813: Q15.B R32.1
N$17
  Top 0.813: Q14.B R28.2
N$18
  Top 0.813: Q14.E 64.04,34 R31.1
N$19
  Bottom 0.61: IC1.2 68.36,27.86 69,28.5 69,31.47 C13.2 68,32.53
  Bottom 0.813: 68,32.53 R29.2
N$20
  Top 0.813: Q15.E 74.96,31.5 R34.2
N$21
  Top 0.813: Q16.E 64.04,31.5 R35.1
N$22
  Bottom 0.61: C13.1 70,31.47 70,29 | IC1.8 70.91,26.59 | 70.91,26.59 70,27.5 70,29 | IC1.6 70.14,29.14 70,29 | R21.1 70.91,24.34 70.91,26.59
N$23
  Top 0.508: Q8.5 125.25,14 125.75,13.5 125.75,12.5 127.25,11 129.25,11 R18.1
N$24
  Bottom 0.254: SJ1.1 108,63.99 U$5.2
N$25
  Top 0.813: D1.C D2.A
N$26
  Top 0.813: D2.C 87.46,43.16 Q25.B 87.46,38.96 86,37.5 78,37.5 76.5,39 R53.2
N$27
  Top 0.813: R55.2 75.5,49 80.3,44.2 D5.C 84.3,39.5 Q30.B
N$28
  Bottom 0.813: Q29.E 79.46,45.54 82,43 Q30.C
N$29
  Bottom 0.813: Q27.C 74.5,41 R59.2 78.46,40.5 Q30.E
N$30
  Bottom 0.813: R60.2 68,41.5 R63.2 | R59.1 71,41.5 R63.2 | R63.2 R66.1
N$31
  Bottom 0.813: R60.1 64.5,41 Q26.C 61,48.5 Q31.E
N$32
  Top 0.813: D6.A 56.2,47.26 Q31.B
  Bottom 0.813: R56.1 64,49 63,50 56.46,50 Q31.B
N$33
  Top 0.813: D6.C 54.96,41.84 Q32.B
  Bottom 0.813: Q28.C 49.5,41 51,42.5 52.46,42.5 Q32.B
N$34
  Top 0.813: R57.2 Q28.E
N$35
  Top 0.813: D3.C D4.A
N$36
  Top 0.813: Q31.C 58.5,47.5 58.5,44 60.04,42.46 Q32.E
N$37
  Top 0.813: Q26.E 65.96,49 R55.1
N$38
  Bottom 0.813: R56.2 73.04,49 Q27.E
N$39
  Top 0.813: 69.5,42 R51.1 C17.1 | 69.5,42 R52.2 | Q27.B 69.5,45 | 69.5,45 Q26.B | 69.5,45 69.5,42
N$40
  Bottom 0.813: Q33.C 89.5,49 88.5,50 83,50 | 83,50 82,49 Q29.C | Q36.B 82.46,50 83,50
N$41
  Top 0.813: Q33.B Q35.B | Q35.C Q35.B | Q36.E Q35.B
N$42
  Top 0.813: R58.1 Q33.E
N$43
  Top 0.813: Q20.E 143.04,25.04 141.5,23.5 R41.2
N$44
  Top 0.813: Q19.E 158.5,23.46 R38.1
N$45
  Top 0.813: R37.2 159.5,29 161.04,27.46 Q19.B LED7.C
N$46
  Top 0.813: LED8.A Q20.B 137.96,26.96 140,29 R37.1
N$47
  Top 0.813: R39.1 155.5,28 157.5,28 158.5,27 Q19.C 160.5,24 164,24 165,25 165,29 R47.2 R42.2
N$48
  Top 0.813: R43.1 R48.1 134,29 134,24.75 135,23.75 139.25,23.75 140.5,25 Q20.C 140.5,26.5 142,28 144.5,28 145.5,27 R40.2
N$49
  Top 0.813: R39.2 150.5,26.5 149.5,27.5 147.81,27.5 147,26.69 147,24.5 146,23.5 145,23.5 143.46,21.96 Q18.E
N$50
  Top 0.813: Q17.E 155.54,22.96 154,24.5 149,24.5 148.5,25 R40.1
N$51
  Top 0.813: Q35.E 95,53 | 95,53 R62.1 | 95,53 94.25,53.75 LED9.A
N$52
  Top 0.813: R42.1 Q21.B
N$53
  Top 0.813: R43.2 Q22.B
N$54
  Top 0.813: R47.1 Q23.B
N$55
  Top 0.813: Q24.B R48.2
N$56
  Top 0.813: Q21.E 154.96,34 R45.2
N$57
  Top 0.813: Q22.E 144.04,34 R46.1
N$58
  Top 0.813: Q23.E 154.96,31.5 R49.2
N$59
  Top 0.813: Q24.E 144.04,31.5 R50.1
N$60
  Bottom 0.61: IC2.2 148.37,28.36 149,29 149,32.03 148,33.03
  Bottom 0.813: R44.2 148,33.03 C16.2
N$61
  Bottom 0.61: R36.1 150,26.25 150,27 | C16.1 150,31.97 150,29.5 | 150,27 150,29.5 | IC2.6 150.13,29.64 150,29.5 | IC2.8 150.09,27.09 150,27
N$62
  Bottom 0.813: Q36.C 82,56.79 Q39.E
N$63
  Top 0.813: LED9.C 90.25,57 Q39.B 86.79,55.79 85.5,54.5 R65.2
N$64
  Top 0.813: Q34.B Q38.B | Q38.C Q38.B | Q38.B Q37.E
N$65
  Top 0.813: R64.2 44.5,53 | 44.5,53 Q38.E | LED10.C 44.75,53.25 44.5,53
N$66
  Top 0.813: Q34.E R61.2
N$67
  Bottom 0.813: Q32.C 57.5,41.5 53,46 51.5,46 50,47.5 Q34.C 50,49.5 51.88,51.38 59.14,51.38 60.04,52.29 Q37.B
N$68
  Bottom 0.813: Q40.E 57.5,56.79 Q37.C
N$69
  Top 0.813: R65.1 55.21,54.5 Q40.B LED10.A
N$70
  Top 0.813: R75.1 73.5,58.95 C19.2 72.55,60 C18.1 73.5,60 74.5,61 78,61 79.04,62.04 Q46.B 81,62.5 81.25,62.75 | Q43.C 86.5,64.5 83,64.5 81.25,62.75 | Q39.C 84.5,59.5 81.25,62.75
  Bottom 0.813: Q45.C 69.5,80.75 66.5,77.75 66.5,71 68.5,69 70.5,69 71,68.5 R73.2 73.25,69.25 79.5,69.25 80.75,68 80.75,64.21 Q46.B
N$71
  Bottom 0.813: Q41.C Q41.B | Q41.B Q43.B | Q41.B R68.2
N$72
  Top 0.813: Q42.C Q42.B Q44.B
  Bottom 0.813: R69.1 58,60.5 54,60.5 52.04,62.46 Q42.B
N$73
  Top 0.813: R67.1 Q41.E
N$74
  Top 0.813: R71.1 Q43.E
N$75
  Top 1.016: LED15.C Q81.E
N$76
  Top 0.813: R70.2 Q42.E
N$77
  Top 0.813: R72.2 Q44.E
N$78
  Top 0.813: Q48.B 76.54,64.5 74.5,64.5 73.96,63.96 Q46.E
  Bottom 0.813: R77.2 71.96,64.5 Q46.E
N$79
  Bottom 0.813: R77.1 68,64 65.5,61.5 61.46,61.5 60.46,62.5 Q47.E 60.5,62.54 60.5,64 59.5,65 56.5,65 55.46,66.04 Q49.B
N$80  (via drill 0.35)
  Top 0.813: R74.2 R74.1 65.45,62.01 C20.1 | C20.1 65.5,58.95 R76.2 | C18.2 67.1,59 C20.1 | Q40.C 54,61.04 Q47.B | Q45.E 72.04,80.04 71.5,79.5 65,79.5 62,76.5 v62,71.5
  Bottom 0.813: Q47.B 55.46,62.54 53,65 52,65 Q44.C 49.5,68.5 52.5,71.5 v62,71.5 62.5,71 62.5,67 64,65.5 R74.2
N$81
  Top 0.813: R78.2 Q48.E
  Top 1.27: Q50.B 76.5,79.46 76.5,72.5 73.96,69.96 Q48.E
N$82
  Top 0.813: R78.1 68,68 66.04,69.96 60.54,69.96 | Q49.E 60.54,69.96 | 60.54,69.96 58.5,72 54,72 52.5,73.5 52.5,78.54 Q51.B
N$83  (via drill 0.5)
  Top 0.813: Q50.E 90,81 v92.5,78.5
  Top 2: R80.2 80.8,77 87.5,77 89,78.5 89,80.96 Q50.E
N$84
  Top 2: R81.1 59.7,79.74 Q51.E
N$85
  Bottom 0.61: IC3.2 70.14,53.37 70.74,52.76 71.79,52.76 71.8,52.75 74,52.75
  Bottom 0.813: R79.2 74,52.75 C21.2
N$86
  Bottom 0.508: IC3.3 68.86,52.37 R82.2
  Bottom 0.813: R82.2 65.5,51.5 65.4,51.6 C22.2
N$87
  Top 0.813: D3.A 52.04,42.16 Q28.B 54.54,37.5 61.5,37.5 64.5,40.5 R53.1
N$88
  Bottom 0.813: R73.1 65.54,67 R74.3 64.5,78.5 66.96,80.96 Q45.B
N$89
  Bottom 0.508: C21.1 73.6,58 68.86,58 | IC3.6 68.86,58 | R69.2 64,58 68.86,58
  Bottom 0.61: C21.1 75.1,59.5 R68.1
N$90
  Top 1.016: R119.2 Q83.E
N$91
  Top 0.61: U$3.6 210.63,11.98 C62.1
N$93
  Top 0.508: Q7.5 94.75,14 94.25,14.5 94.25,16 93.25,17 90.5,17 R13.2
N$94
  Top 0.508: Q7.2 93.75,14 94.25,13.5 94.25,12 93.25,11 90.5,11 R19.2
N$95
  Top 0.305: Q1.5 104.75,13.75 101.5,13.75 | 101.5,13.75 101.25,13.5 Q6.2 | 101.5,13.75 97,13.75 96.25,13 95.34,13 Q7.4
N$96
  Top 0.305: Q6.5 101.25,14.5 101.5,14.25 | 101.5,14.25 104.75,14.25 Q1.2 | Q7.6 96.3,14.95 97,14.25 101.5,14.25
N$97  (via drill 0.35)
  Top 0.508: Q7.3 91.2,13.05 90.75,13.5 LED4.A 90.75,14.5 91.2,14.95 92.25,14.95 | Q7.1 92.25,14.95 | R17.1 97.25,16 v96.25,16 | 92.25,14.95 v92.25,16
  Bottom 0.508: v92.25,16 v96.25,16
N$98
  Top 0.508: R16.1 100.25,11.5 | 100.25,11.5 100.25,12.65 | 100.25,12.65 Q6.1 | Q6.3 102.2,11.95 101.75,11.5 100.25,11.5 | R17.2 100.09,12.5 100.25,12.65
N$99
  Top 0.813: LED2.A 94.21,9 Q3.B 95.29,10 96.75,10 99.75,7 R4.1
N$100
  Top 1.016: D13.C 16.8,65.83 C40.1 16.97,67 | 16.97,67 16.97,68.08 C43.1 15.54,68.5 Q87.B | Q83.C 14,67 16.97,67
N$101
  Top 0.508: Q5.1 117.3,11.95 117.75,11.5 119.25,11.5 | 119.25,11.5 121.25,11.5 121.75,12 R14.1 | Q5.3 119.2,11.55 119.25,11.5 | R15.2 119.25,11.5
N$102
  Top 0.305: Q4.2 114.25,14.5 114.5,14.25 118,14.25 | 118,14.25 118.25,14.5 Q5.5 | 118,14.25 122.5,14.25 123.25,15 124.41,15 Q8.4
N$103  (via drill 0.35)
  Top 0.406: v123.25,16 122.75,15.5 R14.2
  Top 0.508: Q8.1 128.3,13.05 129,13.75 LED3.C 129,14.25 128.3,14.95 Q8.3 127.25,15.15 v127.25,16
  Bottom 0.406: 126.75,16 v123.25,16
  Bottom 0.508: v127.25,16 126.75,16
N$104
  Top 0.305: Q4.5 114.25,13.5 114.5,13.75 118,13.75 | 118,13.75 118.25,13.5 Q5.2 | 118,13.75 122.5,13.75 123.25,13 124.41,13 Q8.6
N$105
  Top 1.016: C43.2 18.45,67.58 C40.2 20.2,65.83 D13.A 19.7,63.5 18.5,62.3 18.5,59.5 19,59 22,59 23,58 R120.1
N$106
  Top 1.016: R120.2 28.04,54.96 Q85.E
N$107
  Top 1.016: R117.1 Q79.E
N$108
  Top 0.813: LED1.C 125.79,6.5 Q2.B 122.29,4.96 120.25,7 R3.2
N$109
  Top 0.813: Q2.E 125.29,9 R5.1
N$110  (via drill 0.35)
  Top 0.508: R6.2 v108.25,14 R8.2
  Bottom 0.813: Q2.C 114.75,7.5 v108.25,14
N$111  (via drill 0.35)
  Top 0.305: 107.5,9.75 R8.1
  Top 0.508: Q1.6 106.55,12.71 v106.75,12.5 | v106.75,10.5 107.5,9.75
  Bottom 0.508: v106.75,12.5 v106.75,10.5
N$112
  Top 0.508: Q1.3 103.8,16.55 105.25,18 R6.1
N$113
  Top 1.016: LED13.A 16.75,59.75 16,59 11.46,59 Q79.B R115.2
N$114
  Top 1.016: Q80.E R118.2
N$115  (via drill 0.35)
  Top 0.508: Q4.3 112.45,15.29 v112.25,15.5 | v112.25,17.5 111.75,18 R9.2
  Bottom 0.508: v112.25,15.5 v112.25,17.5
N$116
  Top 0.305: 111,9.5 R10.2
  Top 0.508: Q4.6 115.2,11.45 113.25,9.5 111,9.5
N$117  (via drill 0.35)
  Top 0.508: R10.1 v110.75,14 R9.1
  Bottom 0.813: Q3.C 103.25,15.5 109.25,15.5 v110.75,14
N$118
  Top 0.813: Q3.E 93.75,6.46 93.75,6.5 R7.2
N$119
  Top 1.016: LED14.C 207,60 208.54,58.46 Q80.B R116.1
N$120
  Top 1.016: Q86.E 195,58.96 R121.1
N$121
  Top 1.016: R121.2 197.25,65 D14.C 198.47,65.17 C41.1 199.55,68.83 C44.1
N$122
  Top 1.016: C44.2 201.53,70.42 C41.2 201.53,65.17 D14.A 202.2,65.5 205,65.5 206,66.5 Q84.C 208.54,69.54 Q88.B
N$123
  Bottom 1.016: Q80.C Q82.C Q82.B Q84.B
N$124
  Top 1.016: R122.1 211,67 Q84.E
N$125
  Top 1.016: LED16.A 210.75,62.5 Q82.E
N$126
  Bottom 1.27: Q90.B 191.04,79 199.54,70.5 Q88.E
N$127
  Bottom 1.016: Q87.E 17.04,77.08 Q89.B
N$128
  Top 0.61: R123.1 23.86,63.87 IC6.6 23.86,67.14 22.7,68.3 C51.1
N$129
  Top 0.61: R124.1 192.87,63.87 IC5.6 192.87,67.86 193.5,68.5 196.5,68.5 197,69 C52.1
N$130
  Top 1.016: R124.2 188.5,57.54 Q86.B
N$131
  Top 1.016: Q85.B 23.96,60.04 R123.2
N$132  (via drill 0.35)
  Top 0.61: C51.2 20.5,71.5 21.74,72.74 25.13,72.74 25.14,72.75 | IC6.2 25.14,72.75 | 25.14,72.75 25.14,73.86 R128.2
  Top 1.016: R128.2 R127.1 27.47,74.03 C53.2
  Bottom 0.61: D20.C D19.A 20.3,70 C51.2
  other vias: 20.5,70.2
N$133  (via drill 0.35)
  Top 0.61: IC6.3 23.86,69.64 24.25,69.25 | 24.25,69.25 28.88,69.25 29.08,69.45 | C49.1 34.95,69.45 35.63,70.14 D17.6 35.63,73.11 37.52,75 Q91.G | D19.C 23.95,69.25 24.25,69.25
  Top 1.016: C47.1 29.08,69.45 C49.1 | Q91.G 42.5,75.5 R125.1
  Bottom 0.61: D19.C D20.A
  other vias: 23.7,69
N$134
  Top 1.016: Q91.S 42.04,72.5 R125.2
N$135  (via drill 0.35)
  Top 0.61: IC5.3 192.87,70.36 192.45,69.95 C50.2 | D18.4 181.59,70.41 | 188.08,69.95 182.05,69.95 181.59,70.41 | Q92.D 180.04,71.96 181.59,70.41
  Top 1.016: C48.2 188.08,69.95 C50.2
  Bottom 0.61: D21.A D22.C 190,69.8 C50.2
  other vias: 190,69.95
N$136
  Top 0.61: 173.54,77.04 R126.2
  Top 1.016: Q92.S 173.54,77.04
N$137  (via drill 0.35)
  Top 0.61: R130.2 194.13,73.64 IC5.2 194.13,69.94 D22.A
  Top 1.016: C54.1 195,76.97 R130.2 R129.1 197,74 C52.2
  Bottom 0.61: D22.A D21.C
  other vias: 193.7,69.5
N$138
  Top 0.813: R132.2 LED18.C
N$139
  Top 1.016: LED17.A R131.1
N$140
  Top 1.016: C1.2 R133.1
N$141
  cutout Top (no thermals): 204.5,14.5 206,13 210.75,17.75 209.25,19.25
  cutout Top (no thermals): 15.62,12.38 17.12,13.88 12.5,18.5 11,17
  cutout Bottom (no thermals): 202.25,16.75 206,13 210.75,17.75 207,21.5
  cutout Bottom (no thermals): 15.75,12.25 19.5,16 14.75,20.75 11,17
N$142  (1 unrouted)
  Bottom 0.254: U$5.7 110.06,59 | 109,59 R139.2
  Bottom 0.813: R138.1 110.55,53.55 C72.1 110.55,57.45 R139.2
N$143
  Top 0.61: U$1.6 10.05,12.45 9.98,12.45 C63.1 | U$1.6
N$145  (1 unrouted)
N$146
  Bottom 0.254: U$5.9 108,59 R136.1
  Bottom 0.813: R136.1 107,56.05 C71.2 106.45,53.55 R137.2
N$148  (1 unrouted)
N$157
  Top 0.254: U$2.11 29,7.83 29,6.23 Q98.4
N$159
  Top 0.813: R86.1 Q52.E
N$160
  Top 0.813: D11.A 163.7,46.66 Q56.B
  Bottom 0.813: Q52.C 164.54,44.96 Q56.B
N$161
  Top 0.813: D7.C D8.A
N$162
  Top 0.813: D8.C 167.46,43.16 Q52.B 167.46,38.96 166,37.5 158,37.5 157,38.5 R85.2
N$163
  Top 0.813: R87.2 155.5,49 160.3,44.2 D11.C 164.3,39.5 Q57.B
N$164
  Bottom 0.813: Q56.E 159.46,45.54 162,43 Q57.C
N$165
  Bottom 0.813: Q54.C 154.5,41 R91.2 158.46,40.5 Q57.E
N$166
  Bottom 0.813: R92.2 148,41.5 R95.2 | R91.1 151,41.5 R95.2 | R95.2 R98.1
N$167
  Bottom 0.813: R92.1 144.5,41 Q53.C 142.5,47 Q58.E
N$168
  Top 0.813: D12.A 136.2,45.76 Q58.B
  Bottom 0.813: R88.1 147,50 142,50 140.5,48.5 136,48.5 134.96,47.46 Q58.B
N$169
  Top 0.813: D12.C 134.96,41.34 Q59.B
  Bottom 0.813: Q55.C 129.5,41 130.5,42 132.46,42 Q59.B
N$170
  Top 0.813: Q55.E R89.2
N$171
  Top 0.813: D9.C D10.A
N$172
  Top 0.813: Q58.C 138.5,46 138.5,44 140.04,42.46 Q59.E
N$173
  Top 0.813: Q53.E 145.96,49 R87.1
N$174
  Bottom 0.813: R88.2 153.04,49 Q54.E
N$175
  Top 0.813: 149.5,42 R83.1 C27.1 | 149.5,42 R84.2 | Q54.B 149.5,45 | 149.5,45 Q53.B | 149.5,45 149.5,42
N$176
  Bottom 0.813: Q60.C 169.5,49 168.5,50 163,50 | 163,50 162,49 Q56.C | Q63.B 162.46,50 163,50
N$177
  Top 0.813: Q60.B Q62.B | Q62.C Q62.B | Q63.E Q62.B
N$178
  Top 0.813: R90.1 Q60.E
N$179
  Top 0.813: Q62.E 174,53 | 174,53 R94.1 | LED11.A 174.25,53.25 174,53
N$180
  Bottom 0.813: Q63.C 162,56.79 Q66.E
N$181
  Top 0.813: R97.2 166.5,54.5 166.79,54.79 Q66.B 167.29,57.5 LED11.C
N$182
  Top 0.813: Q65.C Q65.B Q64.E
  Bottom 0.813: Q65.B Q61.B
N$184  (via drill 0.35)
  Top 0.254: U$2.6 26.38,12.92 v26.48,13.02
  Bottom 0.254: v26.48,13.02 27.48,13.02 28.5,12 34.58,12 Q100.4
  other vias: 34.91,11.68
N$188  (via drill 0.35)
  Top 0.254: U$2.2 28.98,13.16 v29,13.19
  Bottom 0.254: v29,13.19 29,17.58 Q97.4
  other vias: 29.32,17.91
N$189  (via drill 0.35)
  Top 0.254: Q99.4 31,8.42 v31,9.5 | v27,11.36 27,12.14 U$2.5
  Bottom 0.254: v31,9.5 29.14,11.36 v27,11.36
N$201
  Top 0.254: 190.18,14.5 Q106.4
  Top 0.406: U$4.11 191.03,13.47 190.18,14.32 190.18,14.5
N$204  (via drill 0.35)
  Top 0.406: U$4.6 193.62,7.58 v193.48,7.43
  Bottom 0.406: v193.48,7.43 192.57,7.43 191.18,8.82 Q108.4
  other vias: 184.59,8.82
N$208  (via drill 0.35)
  Top 0.406: U$4.2 191.03,7.53 v191,7.5
  Bottom 0.406: v191,7.5 191,3.42 v190.18,2.6
N$209  (via drill 0.35)
  Top 0.406: U$4.5 192.52,8.79 v192.52,9.02
  Bottom 0.406: v192.52,9.02 192.27,9.02 191.91,9.38 191.2,9.38 Q107.4
  other vias: 188.41,12.18
N$231
  Top 0.813: Q65.E R96.2 124.75,53.75 LED12.C
N$232
  Top 0.813: R93.2 124.5,47 Q61.E
N$233
  Top 0.813: Q64.B 140.04,50.54 139,49.5 131.5,49.5 130,48 Q61.C
  Bottom 0.813: Q59.C 137.5,41.5 133.5,45.5 132,45.5 130.5,47 Q61.C
N$234
  Bottom 0.813: Q67.E 137.5,56.29 Q64.C
N$235
  Top 0.813: R97.1 134.71,54.5 Q67.B LED12.A
N$236
  Top 0.813: R107.1 153.5,58.95 C29.2 152.55,60 C28.1 153.5,60 154.5,61 158,61 159.04,62.04 Q73.B 161,62.5 | Q70.C 166.5,64.5 163,64.5 161,62.5 | Q66.C 164.5,59 161,62.5
  Bottom 0.813: Q73.B 161,62.5 161,68.5 159,70.5 154.5,70.5 | 154.5,70.5 154.5,79 153,80.5 150.5,80.5 149.5,81.5 Q72.C | R105.2 154.5,70.5
N$237
  Bottom 0.813: R100.2 164,62.5 Q68.B | Q68.C Q68.B | Q68.B Q70.B
N$238
  Top 0.813: Q69.C Q69.B Q71.B
  Bottom 0.61: Q69.B 133.54,61 140,61 141.5,59.5 R101.1
N$239
  Top 0.813: R99.1 Q68.E
N$240
  Top 0.813: R103.1 Q70.E
N$242
  Top 0.813: R102.2 Q69.E
N$243
  Top 0.813: R104.2 Q71.E
N$244
  Bottom 0.813: Q73.E 153.96,63.96 | Q75.B 159.04,66.04 158,65 155,65 153.96,63.96 | 153.96,63.96 153.67,64.25 R109.2
N$245
  Bottom 0.813: Q76.B 140.46,62.5 | 140.46,62.5 Q74.E | R109.1 145.25,61.5 141.46,61.5 140.46,62.5
N$246
  Top 0.813: C30.1 145.5,58.95 R108.2 | C28.2 147.1,59 C30.1 | C30.1 145.45,62.01 R106.1 | Q67.C 133.5,60.54 Q74.B | Q72.E 152,81.96 152,80.5 151,79.5 145,79.5 143.25,77.75 143.25,72 142.5,71.25 142.5,69.5 | R106.2 142.5,67.5 142.5,69.5 | 142.5,69.5 130.5,69.5 129.5,68.5 Q71.C
  Bottom 0.813: Q71.C 129.5,66.25 130.75,65 134,65 135.46,63.54 Q74.B | R106.1 R106.2
N$247
  Top 0.813: R110.2 Q75.E
  Top 1.27: Q77.B 156.5,79.46 156.5,72.5 153.96,69.96 Q75.E
N$248  (via drill 0.35, 0.5)
  Top 0.813: R110.1 148,68.5 v146,70.5 | Q78.B 130,81 v127,78
  Bottom 0.813: v146,70.5 144.5,70.5 142,68 141.04,68 Q76.E 137.54,70.5 137.5,70.5 137,71 137,75.5 135.5,77 131.5,77 130.04,78.46 Q78.B
N$249
  Top 2: R112.2 160.3,76.5 167,76.5 169,78.5 169,80.96 Q77.E
N$250
  Top 2: R113.1 139.7,79.74 Q78.E
N$251
  Bottom 0.508: IC4.2 149.63,55.63 150.25,56.25 153.35,56.25 153.8,55.8
  Bottom 0.813: R111.2 C31.2 153.8,55.8
N$252
  Bottom 0.508: IC4.3 148.37,51.87 R114.2
  Bottom 0.61: C32.2 144.6,51.5 R114.2
N$253
  Top 0.813: D9.A 132.04,41.66 Q55.B 134.04,37.5 141.5,37.5 144.5,40.5 R85.1
N$254
  Bottom 0.813: Q72.B 146.96,80.54 148.5,79 150.5,79 152.5,77 152.5,71.5 R105.1 146.96,68.04 R106.3
N$255
  Bottom 0.508: C31.1 153.8,58.2
  Bottom 0.61: 153.8,58.2 153.1,57.5 148.25,57.5 | IC4.6 148.37,57.62 148.25,57.5 | R101.2 147.25,56.5 148.25,57.5
  Bottom 0.813: C31.1 155,58.4 156.1,59.5 R100.1
OUT+  (via drill 0.35, 0.4, 0.5)
  Top 0.813: PAD1.P$1 v69.5,51.5 | C1.1 93.35,75.15 v92.5,76
  Top 1.016: v82,71.5 92,71.5 93.35,72.85 C1.1
  Top 2: R80.1 73.7,74.7 71,72 PAD1.P$1 67.5,72 65.3,74.2 R81.2
  Bottom 0.813: R66.2 v69.5,51.5 R82.1
  Bottom 1.016: v82,71.5 70,71.5 PAD1.P$1
OUT-  (via drill 0.35, 0.4, 0.5)
  Top 0.813: v149.5,51.5 PAD2.P$1 | R133.2 125.8,74.3 v127,75.5
  Top 1.016: R133.2 126,73 127.5,71.5 v138.5,71.5
  Top 2: R112.1 150.2,72 PAD2.P$1 148.8,72 R113.2
  Bottom 0.813: R98.2 v149.5,51.5 R114.1
  Bottom 1.016: PAD2.P$1 147.5,74 142.5,74 140,71.5 v138.5,71.5
UOUT+  (via drill 0.35)
  Top 0.508: Q6.6 100.25,15.35 100.25,17 R11.2 101.5,17.5 104.5,20.5 v116.25,20.5 | Q5.6 117.3,16.45 116.25,17.5 v116.25,18
  Top 0.813: Q10.B Q9.B 73.46,18.5 99.75,18.5 R11.2
  Bottom 0.508: v116.25,18 v116.25,20.5
  Bottom 0.813: R21.2 68.54,23.71 Q10.B
UOUT-
  Top 0.508: Q5.4 119.2,17.45 | R20.2 119.45,17.2 119.2,17.45 | Q6.4 102.2,16.45 105,19.25 117.4,19.25 119.2,17.45
  Top 0.813: R20.2 121.25,19 146.04,19 Q18.B 149.04,22 Q17.B
  Bottom 0.813: R36.2 148.54,24.71 Q18.B
UV+
  Top 0.813: U$2.9 27.68,5.67 26,4 Q98.TH 24.5,5.28 C57.1 | Q97.5 Q97.6 25.14,16.64 Q97.TH 25.14,15.37 Q97.7 Q97.8
  pour Top (no thermals): 28,1.25 28,7 23,7 23,1.25
  pour Top (no thermals): 28,13 28,19.5 23,19.5 23,13
  pour Top (no thermals): 15.25,16.25 17,18 23,18 23,13.5 18,13.5
  pour Top (no thermals): 24,5 21,5 21,13.5 18.5,13.5 18.5,1.5 24,1.5
UV+IN
  Top 1.016: LED15.A 4,60.5
  Top 2.54: C37.+ 4,47.92 R115.1 4,60.5 R119.1 C58.2 7.54,72.5 11.5,72.5 | 11.5,72.5 13.04,74.04 C42.2 13.79,76.75 D15.C 21.5,78.3 21.5,80 Q89.C | Q87.C 12,72 11.5,72.5
  pour Top (no thermals): 14.75,16.75 16.5,18.5 16.5,33.5 18,35 18,39 17,40 13,40 12.5,39.5 12.5,19
UV-
  pour Top (rank 2, no thermals): 183.5,13 194,13 194,8 183.5,8
  pour Top (no thermals): 199,9.5 206.25,16.75 204.5,18.5 202.5,18.5 197,13 197,9.5
  pour Top (no thermals): 194,13 197,13 197,10.5 194,10.5
UV-IN
  Top 0.813: Q88.C 206,75.46 | D16.A 197.45,80.05 Q90.C
  Top 1.016: 214.5,64 214.5,63.25 LED16.C
  Top 2.54: 206,75.46 C39.1 208.46,73 211.96,73 C60.1 R122.2 214.5,64 R116.2 214.5,48.25 C38.-
  Bottom 2.54: C39.1 204.96,76.5 199.5,76.5 196.5,79.5 Q90.C
  pour Top (no thermals): 208.5,19 206.75,17.25 205.25,18.75 205.25,31.5 200.75,36 200.75,39.25 202.5,41 204.5,41 208.5,37
V+  (via drill 0.35)  (1 unrouted)
  Top 0.508: 132.38,13.88 LED3.A | v160,22 R38.2
  Top 0.61: C45.2 25.14,64.31 IC6.7 25.14,67.39 v25.25,67.5 | v30.5,72 R127.2 | D1.A 98.7,44.5
  Top 0.813: Q15.C Q13.C | R71.2 R67.2 | R67.2 R62.2 R58.2 98.7,47.3 98.7,44.5 | D1.A 100.2,42 v107.2,42 101,42 R54.2 98.5,38.5 94.54,34.54 C9.1 94.54,33.79 v88.62,27.88 LED5.A 86.75,24.25 v84,21.5 R23.2 | 132.25,13.75 R18.2 R5.2 132.25,6.75 LED1.A 132.5,3.54 C74.1 | 132.25,13.75 132.38,13.88 | R12.2 132.25,13.75 | Q21.C Q23.C | R67.2 C68.1 | C35.+ 164.75,73.71 164.75,70.5 | Q48.C 78.5,69 v82,69
  Top 1.016: R127.2 30.53,74.03 C53.1 30.53,78.93 Q89.E | Q91.D 42,79.5 39.46,82.04 C55.2 35.5,85.75 | v169,27.5 169,26 | Q17.C 153,14.81 C5.+ 152.5,12.31 133.06,12.31 R18.2 | R103.2 178.5,68.5 176.54,70.46 176.38,70.46 176.34,70.5 164.75,70.5 164.75,69.25 160.5,65 156.5,65 | Q73.C 156.5,65 | 156.5,65 Q75.C
  Top 1.27: D15.A 25.05,78.09 Q89.E | R103.2 R99.2 R94.2 R90.2 178.7,47.3 D7.A 178.7,39.7 R86.2 R131.2 178.5,33.96 C11.1 170.54,26 | 170.54,26 169,26 LED7.A | 170.54,26 170.5,25.96 C7.+ C5.+
  Top 4: Q89.E 27.96,83.96 29.75,85.75 35.5,85.75 83.5,85.75 | Q77.C 163.5,84 161.75,85.75 83.5,85.75 | Q50.C 83.5,85.75
  Bottom 0.254: C68.1 105.89,62.94 U$5.1
  Bottom 0.61: v25.25,67.5 29.75,72 v30.5,72 | R141.2 107.5,42.3 v107.2,42
  Bottom 0.813: v160,22 163.5,25.5 163.5,28 160,28 158.5,29.5 Q23.C | Q15.C 81.12,27.88 v88.62,27.88 | C68.1 105.45,64.58 C66.1 106.29,66.26 SJ1.2 | Q9.C 73,21.25 76.75,17.5 86.5,17.5 86.5,19 v84,21.5 | Q48.C Q46.C | C35.+ 163.5,74.96 Q77.C | Q50.C 83.96,80.54 C25.+ 83.96,71.04 | 83.96,71.04 85.5,69.5 | v82,69 83.96,70.96 83.96,71.04
  Bottom 1.016: 163.5,28 168.5,28 v169,27.5
  other vias: 105.45,62.5
V-  (via drill 0.35)  (6 unrouted)
  Top 0.61: C46.1 191.15,72.05 IC5.4 191.59,74.09 R130.1
  Top 0.813: Q16.C Q14.C | Q76.C Q74.C | 120.8,48 D10.C 119.3,42 v110.3,42 118.5,42 R89.1 121,38.96 124.96,35 C10.2 | R104.1 116,62.5 v110.5,62.5 111.5,62.5 R96.1 121,48.2 120.8,48 | Q49.C Q47.C | 40.8,48.3 40.8,48 | 40.8,48 D4.C | R61.1 41,48.2 40.8,48 | R13.1 87.5,14.25 | 87.5,14.25 LED4.C 86.56,13.31 68,13.31 C8.- 66,15.31 Q10.C 66,20 65,19 58.5,19 57.5,20 R26.1 56.19,21.5 C6.- | 87.5,14.25 R19.1 87.5,9.25 LED2.C 87.5,8.75 R7.1 87.5,4.04 C75.2 | Q22.C Q24.C | 120.8,48 121,47.8 R93.1 | 49.5,70.25 49.5,73.04 C26.- | 135,73.96 C36.- 135.04,80.54 Q78.C
  Top 1.016: R130.1 192,76.97 C54.2 v189,77 | C46.1 188.45,72.05 186,74.5 Q92.G 176.5,74 R126.1 | R26.1 53.5,21.5 52.25,22.75 LED6.C
  Top 1.27: D16.C 202.55,80.41 Q90.E | LED6.C 49.46,26 C12.2 41,34.46 R132.1 R57.1 40.8,40.2 D4.C 40.8,48.3 R61.1 R64.1 R70.1 R72.1 41,68 43.25,70.25 49.5,70.25 55.25,70.25 Q49.C
  Bottom 0.254: 111.11,62.94 C67.1
  Bottom 0.61: R140.2 110,42.3 v110.3,42
  Bottom 0.813: C56.1 183,85 | C65.1 111.97,62.92 C67.1 v110.5,62.5 | 141.5,28.5 144,28.5 144.5,28 144.5,25.5 146,24 Q18.C | 141.5,28.5 140.5,29.5 Q24.C | 141.5,28.5 v132,28.5 | Q16.C 60.5,29 61.5,28 63.5,28 64.5,27 64.5,24 66,22.5 Q10.C | Q76.C 138,68 136.5,69.5 135,69.5 135.04,69.54 C36.- | C26.- 55.5,79.04 Q51.C
  Bottom 1.016: v189,77 188,77 186,79 186,85.75 183.75,85.75 183,85
  Bottom 4: Q51.C 55.5,84 57.25,85.75 135.5,85.75 | Q90.E 202,81.04 202,84 200.25,85.75 186,85.75 135.5,85.75 | Q78.C 135.5,85.75
VS+
  Top 0.61: 11.95,12.55 11,11.6 11,8.5 13,6.5 J1.2 | U$1.7 11.95,12.55 | 11.95,12.55
VS-
  Top 0.61: U$3.7 213,11.4 213,10.5 210,7.5 208,7.5 206,5.5 J2.2

## Text on the board
tPlace: MJL4281A | MJL4302A | MJF15030 | MJL4281A | MJL4302A | MJF15030 | MJL4281A | MJL4302A | 4.7uF | 4.7uF | GND | Test | GND | + | + | 10u | 10u | Test | 47nF | 22R | 1k | 0.1uF | 1uF | 1uF | 1k5 | 2k4 | 1k | 2k4 | 1k5 | .1uF | 47p | 100uF | 0.47 | OUT+ | 0.47 | 100uF | 0.47 | OUT- | 0.47 | 100uF | .1uF | DN2540 | 5k | 100uF | 5k | + | DN2540 | 0.1uF | 0.1F | + | OUT+ | ECHU | PHP | OUT- | LT1236-10 | OPA828 | LT1236-10 | 100 | 100 | 100 | 100 | 47p | 10u | 100 | 220 | 220 | 10u | 10uF | .1uF | 100 | 0.1F | Bias | Bias | 10F | Init | Init | OPA828 | 10V | 10V | 10 | 100 | 100 | 100 | 100 | 10 | 10 | V+ | KSC2690 | 47u | KSA1220 | KSC2690 | 47u | KSA1220 | V- | 150p | 150p | 150p | 150p | 10k | 1k | 10 | 1k | 10k | 1M | 1M | 1M | 1M | 68k | 68k | 100 | 100 | 100 | 100 | + | 10 | 10 | 560 | 560 | 560 | 560 | + | 200 | 22p | 1k | 20k | 200 | 200 | 22p | 1k | 20k | 200 | 100k | 100k | V-LED | 10k | 300 | 300 | 300 | 300 | 10k | V+LED | 10 | 10 | 10 | 10 | 10000uF | 10 | 10 | 10 | 10 | 10000uF | .1uF | INPUT | .1uF | .1uF | 300 | 300 | 300 | 300 | 20k | KK396 | 20k | .1uF | KK396 | 10k | 10k | AC | 10 | 10 | 10 | 10 | KK396 | IN- | IN+ | 10 | 10 | 10 | 10 | AC | ACHS / 7122 | Gain | 2k | 2k | Gain | ACHS / 7122 | + | + | .1uF | MOS BSC031N06NS3 G | 250 | 1k | 1k | 250 | N | 10k | N | 689 | 489 | P | 10k | P | .1uF | 250 | 250 | 1k | 1k | .1uF | LT4320 | 1000uF | 1000uF | 10k | 10k | 1000uF | 1000uF | .1uF | 250 | 1uF / 100V | GND S- 5V | 1uF / 100V | 10k | GND S- 5V | 10k | 10k | 250 | Ver 2.1 | MOS BSC031N06NS3 G | 0.1uF | 0.1uF | + | + | N = KSC1845 / P = KSA992 / D = 1N4148 / RED 1.8V
bPlace: 7k | .1uF | 7k | 10uF | 10uF | 1k | 1k | .1uF | .1uF | .1uF | .1uF | 5k | 5k | 5k | 140k | 150k | 5k | 4u | 4u | .1uF | .1uF | .1uF | .1uF | 100k | 100k | 10k | 10k | 100k | 100k | 4u | 4u | 10 | 10 | TPS7A39 | 500 | 500 | Gain | Gain | 10 | 200 | 10 | Jumper / direct op supply | 10 | 200 | 10 | .1uF | .1uF | 10k | 10k | 4u | 4u | .1uF | 10k | 10k | .1uF
bNames: EN
tStop: B C F A II